# EAGLE design act-drive2x2 (EAGLE 8.2.2)
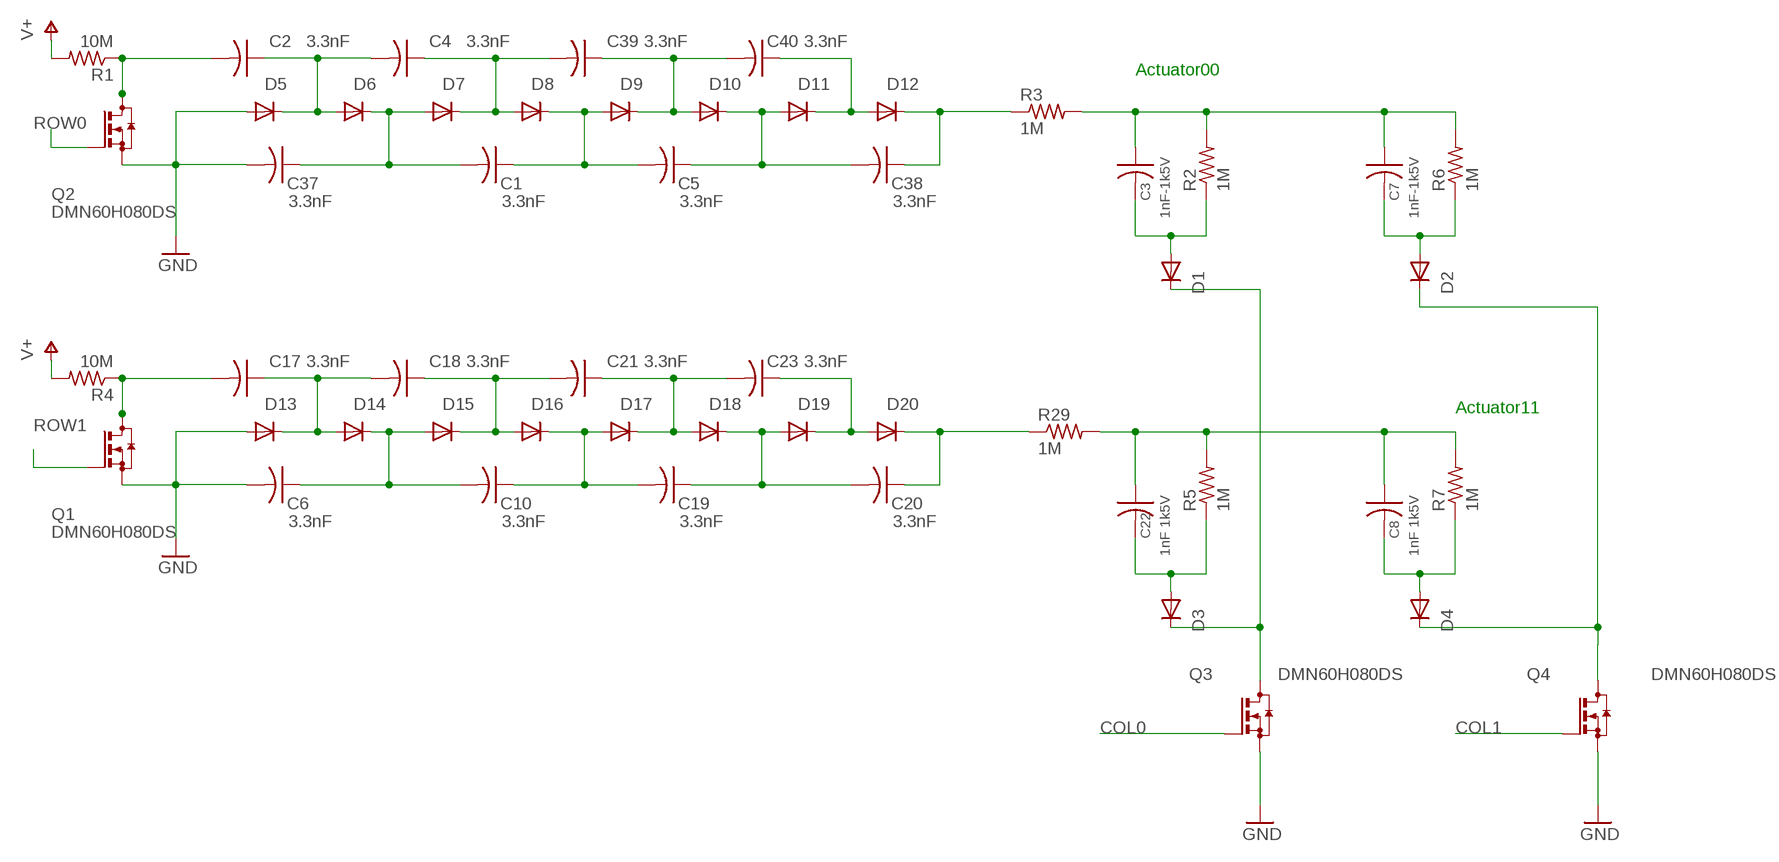
[diagram p0: schematic, sheet 1]

## Parts
C1  3.3nF  C-USC0805K  [C0805K]
C2  3.3nF  C-USC0805K  [C0805K]
C3  1nF-1k5V  C-USC1206  [C1206]
C4  3.3nF  C-USC0805K  [C0805K]
C5  3.3nF  C-USC0805K  [C0805K]
C6  3.3nF  C-USC0805K  [C0805K]
C7  1nF-1k5V  C-USC1206  [C1206]
C8  1nF 1k5V  C-USC1206  [C1206]
C10  3.3nF  C-USC0805K  [C0805K]
C17  3.3nF  C-USC0805K  [C0805K]
C18  3.3nF  C-USC0805K  [C0805K]
C19  3.3nF  C-USC0805K  [C0805K]
C20  3.3nF  C-USC0805K  [C0805K]
C21  3.3nF  C-USC0805K  [C0805K]
C22  1nF 1k5V  C-USC1206  [C1206]
C23  3.3nF  C-USC0805K  [C0805K]
C37  3.3nF  C-USC0805K  [C0805K]
C38  3.3nF  C-USC0805K  [C0805K]
C39  3.3nF  C-USC0805K  [C0805K]
C40  3.3nF  C-USC0805K  [C0805K]
D1  DIODE-SOD323-W  [SOD323-W]
D2  DIODE-SOD323-W  [SOD323-W]
D3  DIODE-SOD323-W  [SOD323-W]
D4  DIODE-SOD323-W  [SOD323-W]
D5  DIODE-SOD323-W  [SOD323-W]
D6  DIODE-SOD323-W  [SOD323-W]
D7  DIODE-SOD323-W  [SOD323-W]
D8  DIODE-SOD323-W  [SOD323-W]
D9  DIODE-SOD323-W  [SOD323-W]
D10  DIODE-SOD323-W  [SOD323-W]
D11  DIODE-SOD323-W  [SOD323-W]
D12  DIODE-SOD323-W  [SOD323-W]
D13  DIODE-SOD323-W  [SOD323-W]
D14  DIODE-SOD323-W  [SOD323-W]
D15  DIODE-SOD323-W  [SOD323-W]
D16  DIODE-SOD323-W  [SOD323-W]
D17  DIODE-SOD323-W  [SOD323-W]
D18  DIODE-SOD323-W  [SOD323-W]
D19  DIODE-SOD323-W  [SOD323-W]
D20  DIODE-SOD323-W  [SOD323-W]
Q1  BSS123  [SOT23]
Q2  BSS123  [SOT23]
Q3  BSS123  [SOT23]
Q4  BSS123  [SOT23]
R1  10M  R-US_R1206  [R1206]
R2  1M  R-US_R1206  [R1206]
R3  1M  R-US_R1206  [R1206]
R4  10M  R-US_R1206  [R1206]
R5  1M  R-US_R1206  [R1206]
R6  1M  R-US_R1206  [R1206]
R7  1M  R-US_R1206  [R1206]
R29  1M  R-US_R1206  [R1206]

## Nets
COL0: Q3.1(G)
COL1: Q4.1(G)
GND: C6.2 C37.2 D5.A D13.A Q1.2(S) Q2.2(S) Q3.2(S) Q4.2(S)
N$1: C1.1 C5.2 D8.C D9.A
N$2: C2.1 C4.2 D5.C D6.A
N$3: C38.1 D12.C R3.1
N$4: C3.2 D1.A R2.1
N$5: C1.2 C37.1 D6.C D7.A
N$6: C22.2 D3.A R5.1
N$7: C4.1 C39.2 D7.C D8.A
N$8: C2.2 Q2.3(D) R1.1
N$9: C20.1 D20.C R29.1
N$10: C39.1 C40.2 D9.C D10.A
N$11: C17.1 C18.2 D13.C D14.A
N$12: C7.2 D2.A R6.1
N$13: C6.1 C10.2 D14.C D15.A
N$14: C23.1 D19.C D20.A
N$15: C10.1 C19.2 D16.C D17.A
N$16: C19.1 C20.2 D18.C D19.A
N$17: C8.2 D4.A R7.1
N$18: D1.C D3.C Q3.3(D)
N$19: D2.C D4.C Q4.3(D)
N$21: C18.1 C21.2 D15.C D16.A
N$22: C21.1 C23.2 D17.C D18.A
N$23: C17.2 Q1.3(D) R4.1
N$59: C40.1 D11.C D12.A
N$61: C5.1 C38.2 D10.C D11.A
ROW0: Q2.1(G)
ROW1: Q1.1(G)
V+: R1.2 R4.2
VO0: C3.1 C7.1 R2.2 R3.2 R6.2
VO1: C8.1 C22.1 R5.2 R7.2 R29.2

## Notes on the sheet
- Actuator00
- Actuator11

## Library data of the parts
C1-C8 C10 C17-C23 C37-C40 = rcl:C-US: CAPACITOR, American symbol
D1-D20 = diode:DIODE-: DIODE; PANASONIC: DA2JF8100L
Q1-Q4 = transistor-small-signal:BSS123: N-CHANNEL MOS FET; PART#: DMN60H080DS
R1-R7 R29 = rcl:R-US_: RESISTOR, American symbol

## Net classes
0 default: clearance 0.205 mm

## Board
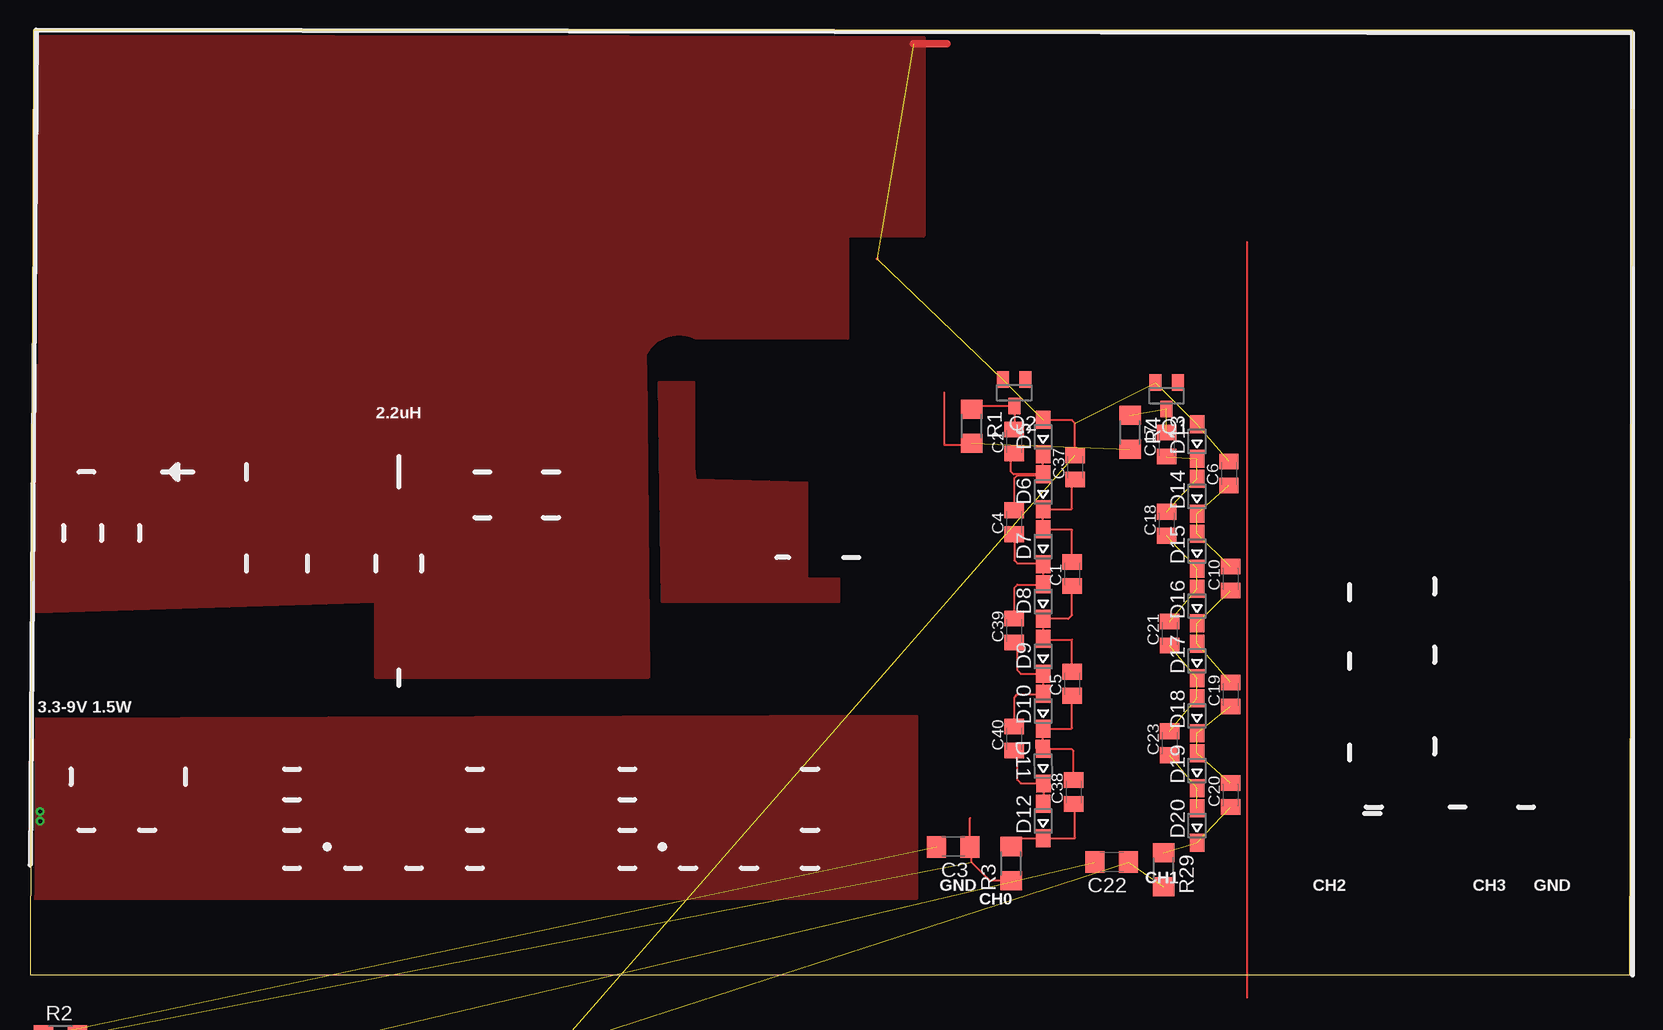
[diagram p1: board, top side]
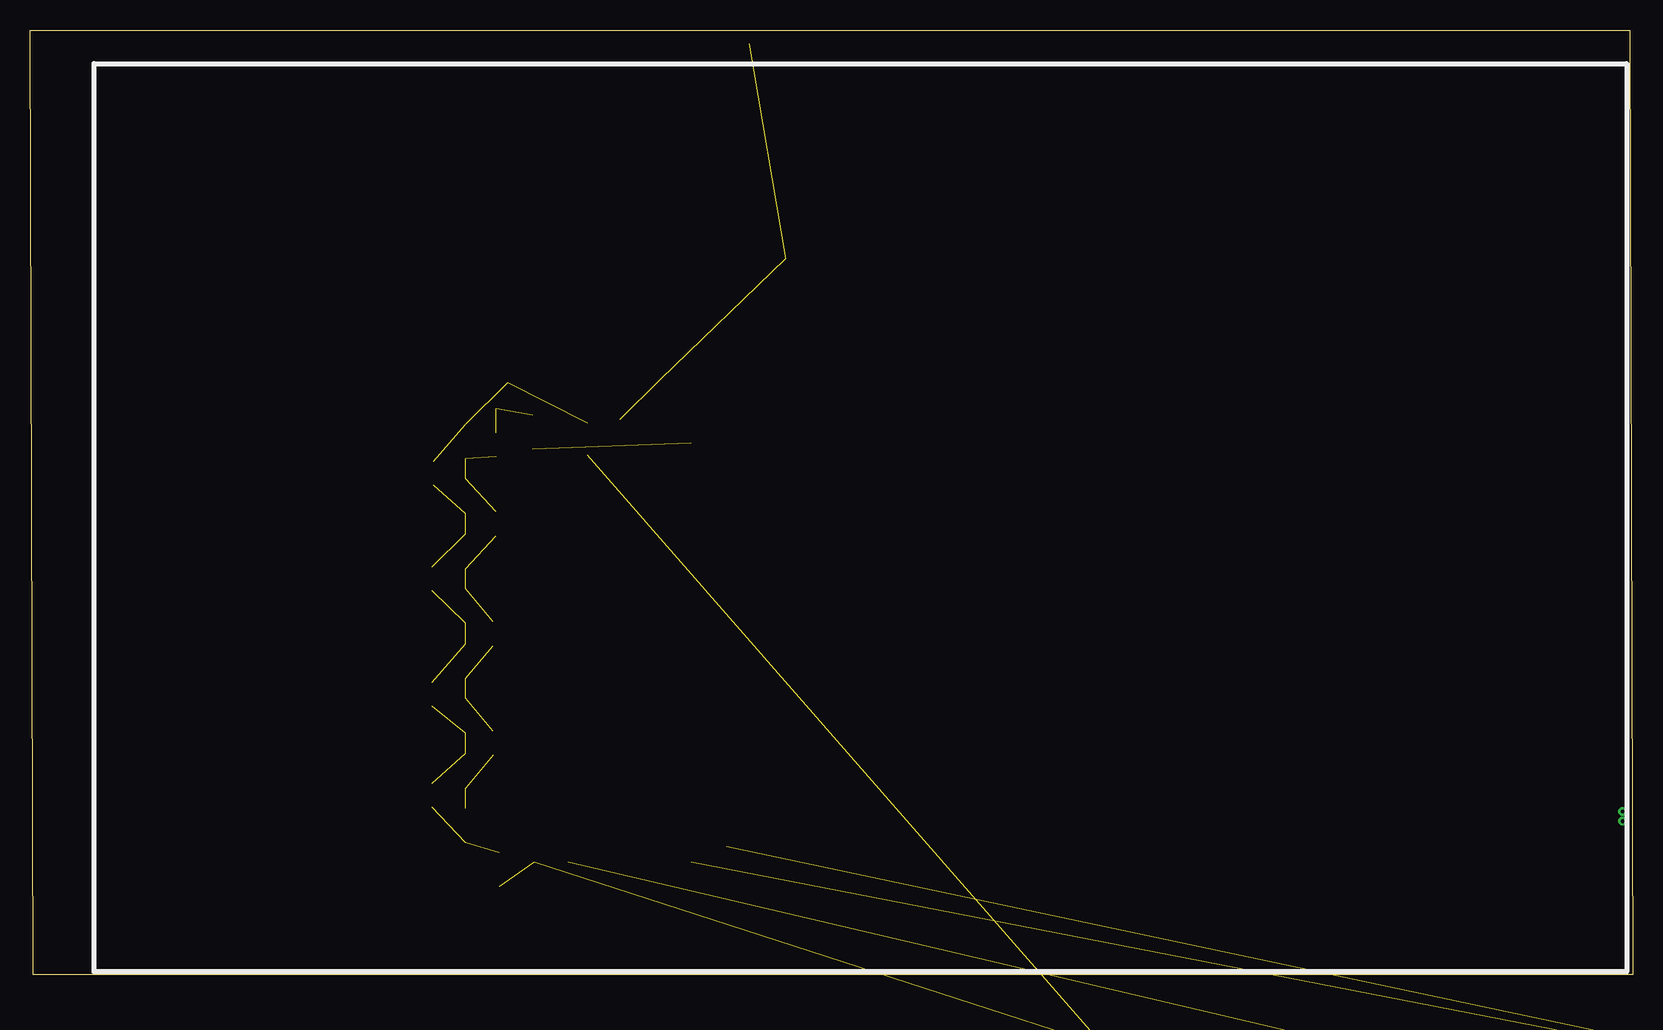
[diagram p2: board, bottom side, seen from below]

Size 133.6 x 78.74 mm. Coordinates in mm from the lower left corner, seen from the top.
Outline: 0,0 133.35,0 133.6,78.74 0.25,78.74 0,0
Copper layers (1*16): Top 0.035mm / dielectric 1.5mm / Bottom 0.035mm
Design rules "default *": minimum track width 6mil, minimum drill 10mil, track to track 6mil, track to pad 6mil, pad to pad 6mil, via to via 6mil, smd to smd 6mil, copper to edge 10mil, drill to drill 8mil, minimum pad ring 10mil, minimum via ring 8mil, stop-mask expansion 4mil, vias tented up to drill 0mil, thermal gap 10mil

### Footprints (pad centres in the part's own frame; a part is rotated, then mirrored left to right if it is on the bottom)
C0805K = smd 1.3 x 1.6: 1 -1,0; 2 1,0
C1206 = smd 1.6 x 1.8: 1 -1.4,0; 2 1.4,0
SOD323-W = smd 1.5 x 1.2: A 1.45,0; C -1.45,0
SOT23 = smd 1 x 1.4: 1 -0.95,-1.1; 2 0.95,-1.1; 3 0,1.1
R1206 = smd 1.6 x 1.803: 1 -1.422,0; 2 1.422,0

### Placement (x,y rotation side)
C1  86.87,33.4 90 top
C2  82.04,44.45 90 top
C3  76.96,10.67 180 top
C4  82.04,37.72 90 top
C5  86.87,24.26 90 top
C6  99.95,41.78 90 top
C7  2.54,-23.37 0 top  (outside the outline)
C8  2.54,-29.46 0 top  (outside the outline)
C10  100.08,33.02 90 top
C17  94.74,44.2 90 top
C18  94.74,37.59 90 top
C19  100.08,23.37 90 top
C20  100.08,14.99 90 top
C21  95,28.45 90 top
C22  90.17,9.4 180 top
C23  95,19.3 90 top
C37  87.12,42.29 90 top
C38  87,15.24 90 top
C39  82.04,28.7 90 top
C40  82.04,19.68 90 top
D1  3.81,-35.31 0 top  (outside the outline)
D2  3.81,-39.12 0 top  (outside the outline)
D3  3.81,-42.93 0 top  (outside the outline)
D4  3.81,-46.74 0 top  (outside the outline)
D5  84.45,44.83 90 top
D6  84.45,40.26 90 top
D7  84.45,35.69 90 top
D8  84.45,31.11 90 top
D9  84.45,26.54 90 top
D10  84.45,21.97 90 top
D11  84.45,17.4 90.8 top
D12  84.45,12.83 90 top
D13  97.28,44.45 90 top
D14  97.28,39.88 90 top
D15  97.28,35.31 90 top
D16  97.28,30.73 90 top
D17  97.28,26.16 90 top
D18  97.28,21.59 90 top
D19  97.28,17.02 90 top
D20  97.28,12.45 90 top
Q1  94.74,48.26 180 top
Q2  82.04,48.51 180 top
Q3  2.29,-51.56 0 top  (outside the outline)
Q4  2.29,-58.93 0 top  (outside the outline)
R1  78.49,45.72 270 top
R2  2.54,-5.08 0 top  (outside the outline)
R3  81.79,9.27 270 top
R4  91.69,45.21 270 top
R5  2.54,-11.18 0 top  (outside the outline)
R6  2.54,-17.27 0 top  (outside the outline)
R7  7.62,-17.27 0 top  (outside the outline)
R29  94.49,8.76 270 top

### Tracks (layer width: path | path; a pad name or v marks a point on that pad's centre or on a via)
GND  (8 unrouted)
  Top 0.152: C37.2 87.12,45.97 86.87,46.23 84.51,46.23 D5.A
  Top 0.254: 70.61,59.69 70.61,59.67
  Top 0.61: 73.66,77.6 76.45,77.6
  pour Top (isolate 0.254): 51.31,50.8 51.56,24.77 28.83,24.77 28.83,31.11 0.51,30.23 0.25,50.8
  pour Top (isolate 0.254): 0.76,48.01 51.31,48.13 51.31,51.69 arc-90 55.5,53.09 68.2,53.09 68.2,61.59 74.55,61.59 74.55,78.11 0.76,78.23
  pour Top (isolate 0.813): 52.45,49.4 52.7,31.11 67.44,31.11 67.44,33.02 64.77,33.02 64.77,41.02 55.5,41.27 55.37,42.16 55.37,49.4
GNDA  (via drill 0.3 pad 0.65)
  other vias: 0.85,12.8 0.85,13.63
  pour Top (isolate 0.305): 0.25,21.34 73.91,21.59 73.91,6.35 0.25,6.35
N$1
  Top 0.152: C5.2 86.87,27.94 84.53,27.94 | 84.53,27.94 84.51,27.94 D9.A | C1.1 86.87,29.97 86.56,29.66 D8.C 84.45,28.02 84.53,27.94
N$2
  Top 0.152: 84.45,41.87 D5.C | 84.45,41.87 D6.A | C4.2 82.04,41.4 82.3,41.66 | 82.3,41.66 84.24,41.66 84.45,41.87 | D6.A 82.35,41.71 82.3,41.66 | D6.A 81.99,41.71 81.79,41.91 81.79,43.2 C2.1
N$3
  Top 0.152: R3.1 82.47,11.38 D12.C 87.07,11.38 87.12,11.43 87.12,14.11 C38.1
N$4  (2 unrouted)
N$5
  Top 0.152: C1.2 86.87,37.08 84.51,37.08 D7.A D6.C 86.82,38.81 86.87,38.86 86.87,41.04 C37.1
N$6  (2 unrouted)
N$7
  Top 0.152: C39.2 82.04,32.26 82.3,32.51 84.4,32.51 D8.A D7.C 84.4,34.29 82.3,34.29 82.04,34.54 C4.1
N$8
  Top 0.152: R1.1 78.76,47.41 Q2.3 C2.2
N$9  (2 unrouted)
N$10
  Top 0.152: C40.2 82.04,23.11 82.3,23.37 84.4,23.37 D10.A D9.C 82.6,25.09 82.3,25.4 82.3,27.45 C39.1
N$11  (3 unrouted)
N$12  (2 unrouted)
N$13  (3 unrouted)
N$14  (2 unrouted)
N$15  (3 unrouted)
N$16  (3 unrouted)
N$17  (2 unrouted)
N$18  (2 unrouted)
N$19  (2 unrouted)
N$21  (3 unrouted)
N$22  (3 unrouted)
N$23  (2 unrouted)
N$28
  Top 0.152: 101.47,-1.91 101.47,61.09
N$59
  Top 0.152: C40.1 82.3,18.43 82.3,16.26 82.6,15.95 D11.C 84.48,14.3 D12.A
N$61
  Top 0.152: C38.2 87,18.67 86.87,18.8 84.49,18.8 D11.A 84.44,20.5 D10.C 86.82,20.52 86.87,20.57 C5.1
V+  (1 unrouted)
  Top 0.152: 76.2,48.51 76.2,44.2 78.38,44.2 R1.2
VO0  (3 unrouted)
  Top 0.152: 81.92,7.72 R3.2 80.04,7.85 78.49,9.4 78.49,10.54 C3.1 78.36,13.05
VO1  (4 unrouted)

### Text on the board
tPlace: 2.2uH | 3.3-9V 1.5W | CH1 | GND | CH2 | CH3 | GND | CH0